# Altium schematic sheet BUTTON_N_ADCREAD.SchDoc
size A4; SheetNumber: 8; SheetTotal: 8
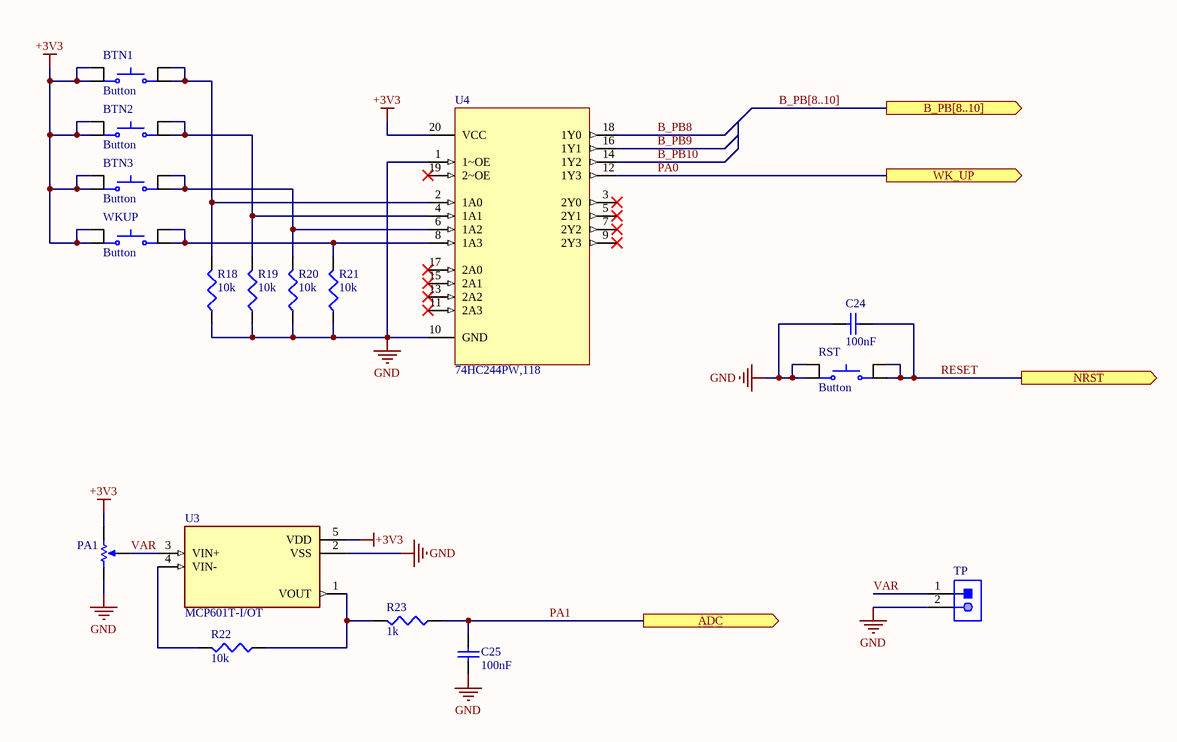
[diagram p0: BUTTON_N_ADCREAD.SchDoc]

## Parts
BTN1  Button  [SW_1571563-7]
BTN2  Button  [SW_1571563-7]
BTN3  Button  [SW_1571563-7]
C24  100nF  [CAPC0805(2012)145_L]
C25  100nF  [CAPC0805(2012)145_L]
PA1  3362P-1-104LF  [BOUR-3362P]  (value not drawn)
R18  10k  [0805 (2012 Metric)]
R19  10k  [0805 (2012 Metric)]
R20  10k  [0805 (2012 Metric)]
R21  10k  [0805 (2012 Metric)]
R22  10k  [0805 (2012 Metric)]
R23  value 1k  [0805 (2012 Metric)]  (hidden comment: 10k)
RST  Button  [SW_1571563-7]
TP  B2P-VH(LF)(SN)  [JST-B2P-VH(LF)(SN)_V]  (value not drawn)
U3  MCP601T-I/OT  [SOT95P280X145-5N]
U4  74HC244PW,118  [TSSOP-20]
WKUP  Button  [SW_1571563-7]

## Ports
ADC (out), B_PB[8..10] (out), NRST (out), WK_UP (out)

## Nets
+3V3: BTN1.1(COM) BTN1.2(COM) BTN2.1(COM) BTN2.2(COM) BTN3.1(COM) BTN3.2(COM) PA1.3(CW) U3.5(VDD) U4.20(VCC) WKUP.1(COM) WKUP.2(COM)
GND: C24.2 C25.1 PA1.1(CCW) R18.1 R19.1 R20.1 R21.1 RST.1(COM) RST.2(COM) TP.2 U3.2(VSS) U4.1(1~OE) U4.10(GND)
B_PB8: U4.18(1Y0)
B_PB9: U4.16(1Y1)
B_PB10: U4.14(1Y2)
PA0: U4.12(1Y3) ; port WK_UP
PA1: C25.2 R23.1 ; port ADC
RESET: C24.1 RST.3(NO) RST.4(NO) ; port NRST
VAR: PA1.2(S) TP.1 U3.3(VIN+)
NetBTN1_3: BTN1.3(NO) BTN1.4(NO) R18.2 U4.2(1A0)
NetBTN2_3: BTN2.3(NO) BTN2.4(NO) R19.2 U4.4(1A1)
NetBTN3_3: BTN3.3(NO) BTN3.4(NO) R20.2 U4.6(1A2)
NetR21_2: R21.2 U4.8(1A3) WKUP.3(NO) WKUP.4(NO)
NetR22_1: R22.1 R23.2 U3.1(VOUT)
NetR22_2: R22.2 U3.4(VIN-)

Not connected (* = marked no-connect by the designer): U4 3(2Y0)* 5(2Y1)* 7(2Y2)* 9(2Y3)* 11(2A3)* 13(2A2)* 15(2A1)* 17(2A0)* 19(2~OE)*

## Buses and harness runs
bus B_PB[8..10] = port B_PB[8..10]

## Library data of the parts
BTN1-BTN3 RST WKUP = CMP-011-00013-6: Switch Tactile OFF (ON) SPST Round Button Gull Wing 0.05A 24VDC 1VA 0.98N SMD Loose; MF: TE Connectivity; MP: 1571563-7; Price: None; SnapEDA_Link: https://www.snapeda.com/parts/1571563-7/TE%20Connectivity/view-part/2365663/?ref=snap; Value: *; Design Item ID: button; Availability: Unavailable; Source: others.SchLib; Case/Package: SMD-6 Omron Electronics; EU_RoHS_Compliance: Compliant; JLCPCB Part #: C592980
C24 C25 = CMP-001-00081-5: Chip Capacitor, 100nF +/-40%, 16V, 0805, Thickness 1.45 mm; Tolerance: 5%; Min Operating Temperature: -55°C; Case/Package: 0805; Pins: 2; Max Operating Temperature: 85°C; Voltage Rating: 16V; Mounting Technology: SMT; Value: 100nF
PA1 = CMP-009-00040-2: Square Trimpot(R) Trimming Potentiometer, 100 KOhm, 300 V, -55 to 125 degC, 3-Pin THD, RoHS, Tube, https://www.thegioiic.com/3296x-104-bien-tro-100-kohm-3-chan-tinh-chinh-ngang-0-5w; Manufacturer: Bourns; Voltage Rating: 300V; Resistance: 100k; Power: 500mW; Tolerance: 10%; RoHS Compliant: True; Mounting Technology: TH; Datasheet URL: http://www.bourns.com/docs/Product-Datasheets/3362.pdf; Min Operating Temperature: -55°C; Composition: Potentiometer; Package Quantity: 250; Lead Pitch: 2.54mm; Case/Package: 3326P; Package Description: 3-Pin Through Hole Device, Body 6.6 x 6.99 mm, Pitch 2.54 mm; Datasheet Version: May-16; Packaging: Rail/Tube; Package Reference: 3326P; Manufacturer URL: http://www.bourns.com/; Max Operating Temperature: 125°C; JLCPCB Part #: C81266
R18-R23 = CMP-009-00179-13: Oreki; ComponentLink1Description: DigiKey; RoHS Compliant: Yes; Mounting Technology: SMT; Pins: 2; Case/Package: Chip
  R18-R22: Value: 10k
TP = CMP-002-00025-3: Manufacturer: JST; Gender: Male; Connector Type: Header; Datasheet URL: http://www.jst-mfg.com/product/pdf/eng/eVH.pdf; Datasheet Version: May-16; Package Reference: B2P-VH(LF)(SN); Max Operating Temperature: 85°C; RoHS Compliant: Unknown; Mounting Technology: TH; Package Description: Male Header, Pitch 3.96 mm, 1 x 2 Position, Height 10.9 mm, Tail Length 3.7 mm; Min Operating Temperature: -25°C; Manufacturer URL: http://www.jst.com/home2.html; Case/Package: B2P-VH(LF)(SN)
U3 = CMP-014-00006-3: General Purpose Amplifier 1 Circuit Rail-to-Rail SOT-23-5; MF: Microchip; Design Item ID: MCP601T-I/OT; SnapEDA_Link: https://www.snapeda.com/parts/MCP601T-I/OT/Microchip/view-part/43729/?ref=snap; Component Type: Standard; MP: MCP601T-I/OT; Price: None; Case/Package: SOT-23 Microchip; Pins: 5; Source: SnapEDAsch.SchLib; Value: *; Availability: Unavailable; JLCPCB Part #: C128440
U4 = CMP-003-000004-5: 4 7.8mA 2V~6V 7.8mA 2 TSSOP-20  Buffer/Driver/Transceiver ROHS; MP: altium_native_batch; JLCPCB Part #: C5623; Source: 74HC244D,653.SchLib; RoHS Compliant: Yes; Value: *; Availability: Unavailable; Pin Count: 20; Price: None; Component Type: Standard; Package: None; Design Item ID: 74HC244PW,118